# EAGLE design familab_pov_finished (EAGLE 6.5.0)
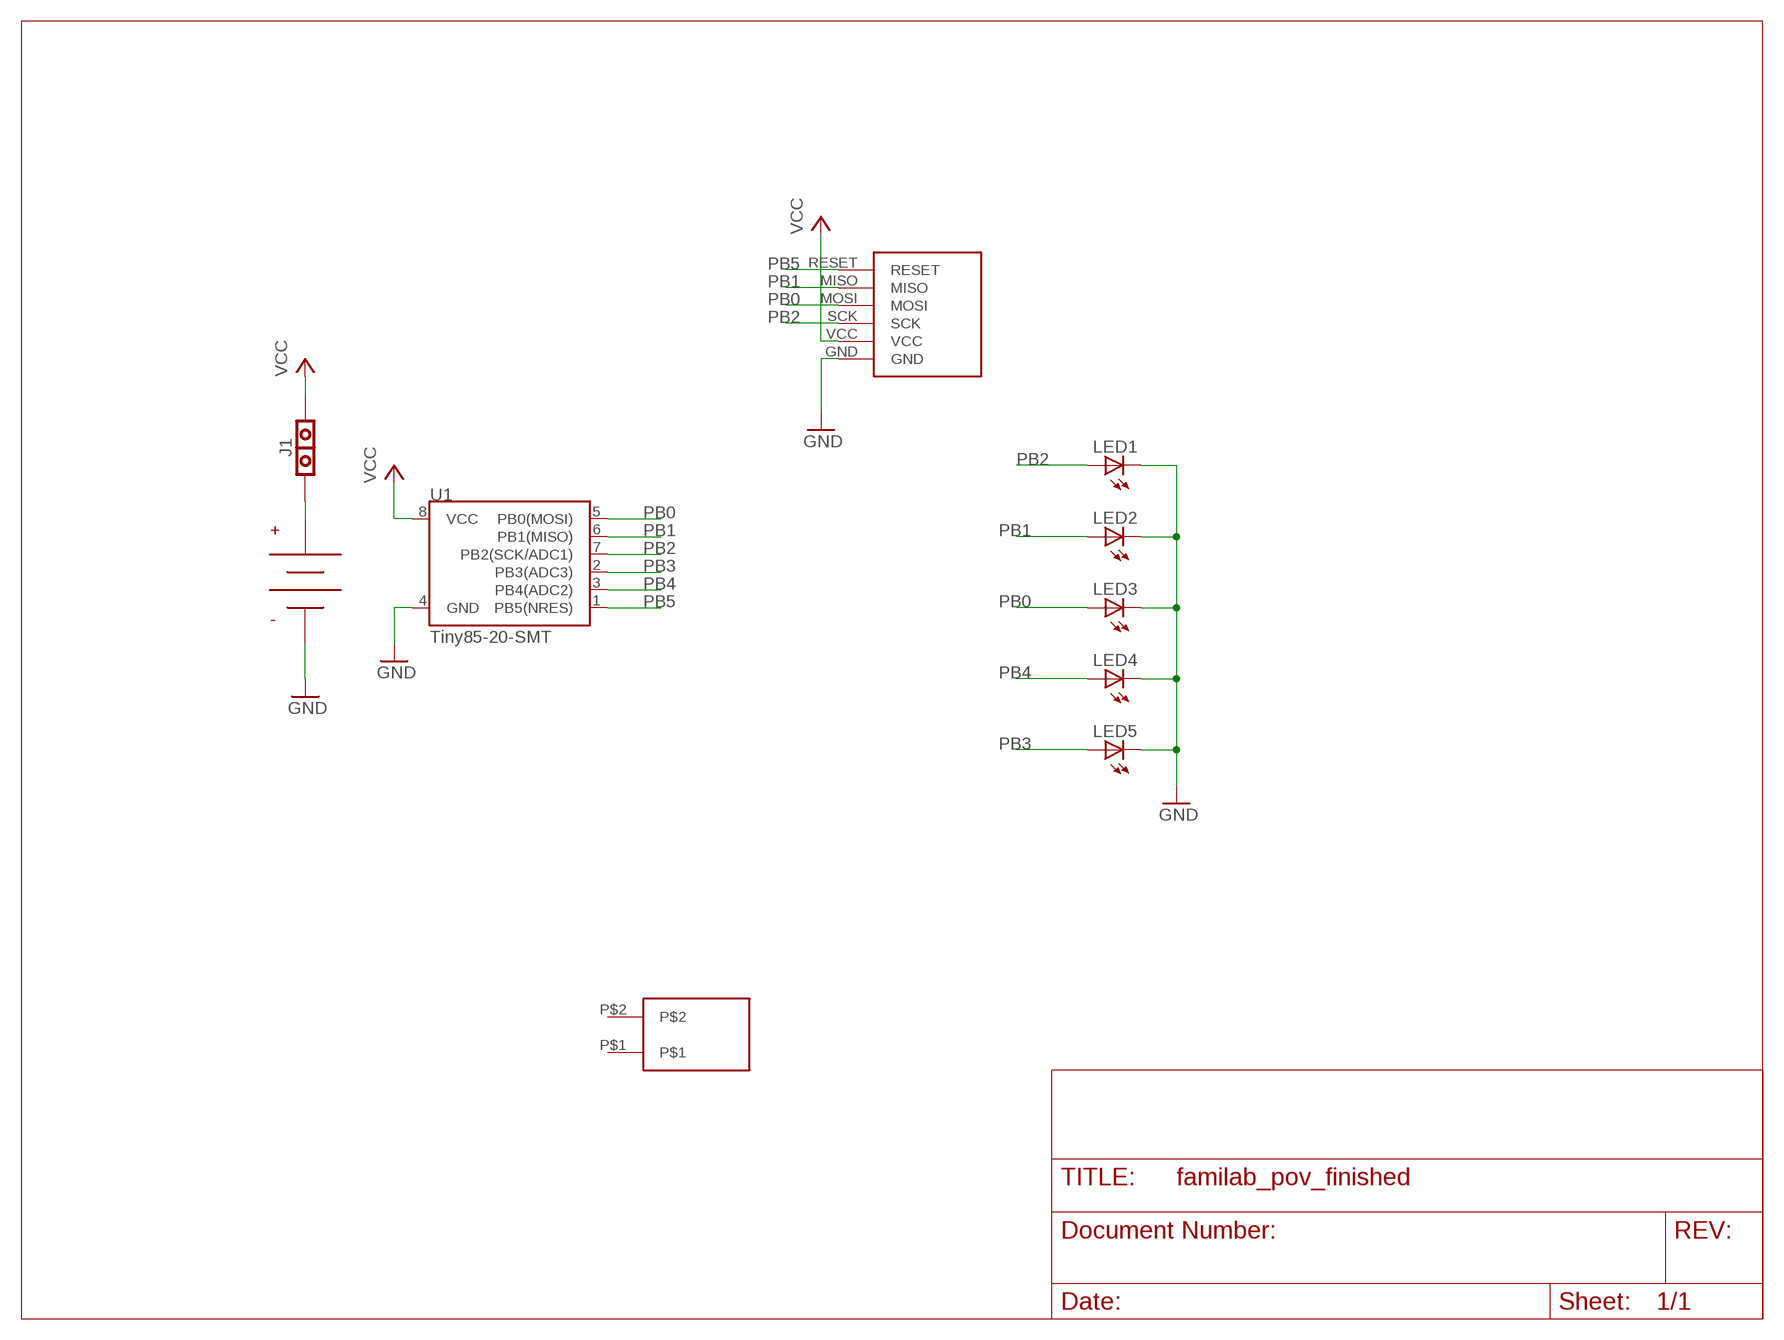
[diagram p0: schematic, sheet 1]

## Parts
J1  JUMPERSIDE  [JUMPER_SMD_SIDE]
LED1  LEDLED_5MM_SMD_SIDE  [LED5MM_SMD_SIDE]
LED2  LEDLED_5MM_SMD_SIDE  [LED5MM_SMD_SIDE]
LED3  LEDLED_5MM_SMD_SIDE  [LED5MM_SMD_SIDE]
LED4  LEDLED_5MM_SMD_SIDE  [LED5MM_SMD_SIDE]
LED5  LEDLED_5MM_SMD_SIDE  [LED5MM_SMD_SIDE]
U1  Tiny85-20-SMT  ATTINY45TINY85-20-SMT  [SO08-EIAJ]
U$1  CR2032_HOLDER  [CR2032_BC2032-F1]
U$2  MOUNTING_PAD  [MOUNTING_PADS]
U$4  ICSP_PROGRAM  [POV_ISP_CONNECTOR]

## Nets
GND: LED1.CATHODE(C) LED2.CATHODE(C) LED3.CATHODE(C) LED4.CATHODE(C) LED5.CATHODE(C) U1.4(GND) U$1.NEG U$4.GND
N$1: J1.P$1 U$1.POS
PB0: LED3.ANODE(A) U1.5(PB0(MOSI)) U$4.MOSI
PB1: LED2.ANODE(A) U1.6(PB1(MISO)) U$4.MISO
PB2: LED1.ANODE(A) U1.7(PB2(SCK/ADC1)) U$4.SCK
PB3: LED5.ANODE(A) U1.2(PB3(ADC3))
PB4: LED4.ANODE(A) U1.3(PB4(ADC2))
PB5: U1.1(PB5(NRES)) U$4.RESET
VCC: J1.P$2 U1.8(VCC) U$4.VCC
Unconnected: U$2.P$1 U$2.P$2

## Library data of the parts
J1 = pov_class_finished:JUMPER: JUMPER 2-PIN 0.1" PITCH FOR STANDARD HEADERS
LED1-LED5 = pov_class:LED: LED OSRAM: - CHIPLED LG R971, LG N971, LY N971, LG Q971, LY Q971, LO R971, LY R971 LH N974, LH R974 LS Q976, LO Q976, LY Q976 LO Q996 - Hyper CHIPLED LW Q18S LB Q993, LB Q99A, LB R99A - SideLED LS A670, LO A670, LY A670, LG A670, LP A670 LB A673, LV A673, LT A673, LW A673 LH A674 LY A675 LS A676, LA A676, LO A676, LY A676, LW A676 LS A679, LY A679, LG A679 - Hyper Micro SIDELED® LS Y876, LA Y876, LO Y876, LY Y876 LT Y87S - SmartLED LW L88C, LW L88S LB L89C, LB L89S, LG L890 LS L89K, LO L89K, LY L89K LS L896, LA L896, LO L896, LY L896 - TOPLED LS T670, LO T670, LY T670, LG T670, LP T670 LSG T670, LSP T670, LSY T670, LOP T670, LYG T670 LG T671, LOG T671, LSG T671 LB T673, LV T673, LT T673, LW T673 LH T674 LS T676, LA T676, LO T676, LY T676, LB T676, LH T676, LSB T676, LW T676 LB T67C, LV T67C, LT T67C, LS T67K, LO T67K, LY T67K, LW E67C LS E67B, LA E67B, LO E67B, LY E67B, LB E67C, LV E67C, LT E67C LW T67C LS T679, LY T679, LG T679 LS T770, LO T770, LY T770, LG T770, LP T770 LB T773, LV T773, LT T773, LW T773 LH T774 LS E675, LA E675, LY E675, LS T675 LS T776, LA T776, LO T776, LY T776, LB T776 LHGB T686 LT T68C, LB T68C - Hyper Mini TOPLED® LB M676 - Mini TOPLED Santana® LG M470 LS M47K, LO M47K, LY M47K Source: http://www.osram.convergy.de LUXEON: - LUMILED® LXK2-PW12-R00, LXK2-PW12-S00, LXK2-PW14-U00, LXK2-PW14-V00 LXK2-PM12-R00, LXK2-PM12-S00, LXK2-PM14-U00 LXK2-PE12-Q00, LXK2-PE12-R00, LXK2-PE12-S00, LXK2-PE14-T00, LXK2-PE14-U00 LXK2-PB12-K00, LXK2-PB12-L00, LXK2-PB12-M00, LXK2-PB14-N00, LXK2-PB14-P00, LXK2-PB14-Q00 LXK2-PR12-L00, LXK2-PR12-M00, LXK2-PR14-Q00, LXK2-PR14-R00 LXK2-PD12-Q00, LXK2-PD12-R00, LXK2-PD12-S00 LXK2-PH12-R00, LXK2-PH12-S00 LXK2-PL12-P00, LXK2-PL12-Q00, LXK2-PL12-R00 Source: www.luxeon.com KINGBRIGHT: KA-3528ASYC Source: www.kingbright.com
U1 = SparkFun-DigitalIC:ATTINY45: Atmel 8-pin 2/4/8kB flash uC; PROD_ID: IC-09092
U$1 = pov_class:CR2032_HOLDER
U$2 = pov_class:MOUNTING_PAD
U$4 = pov_class_finished:ICSP_PROGRAM

## Board
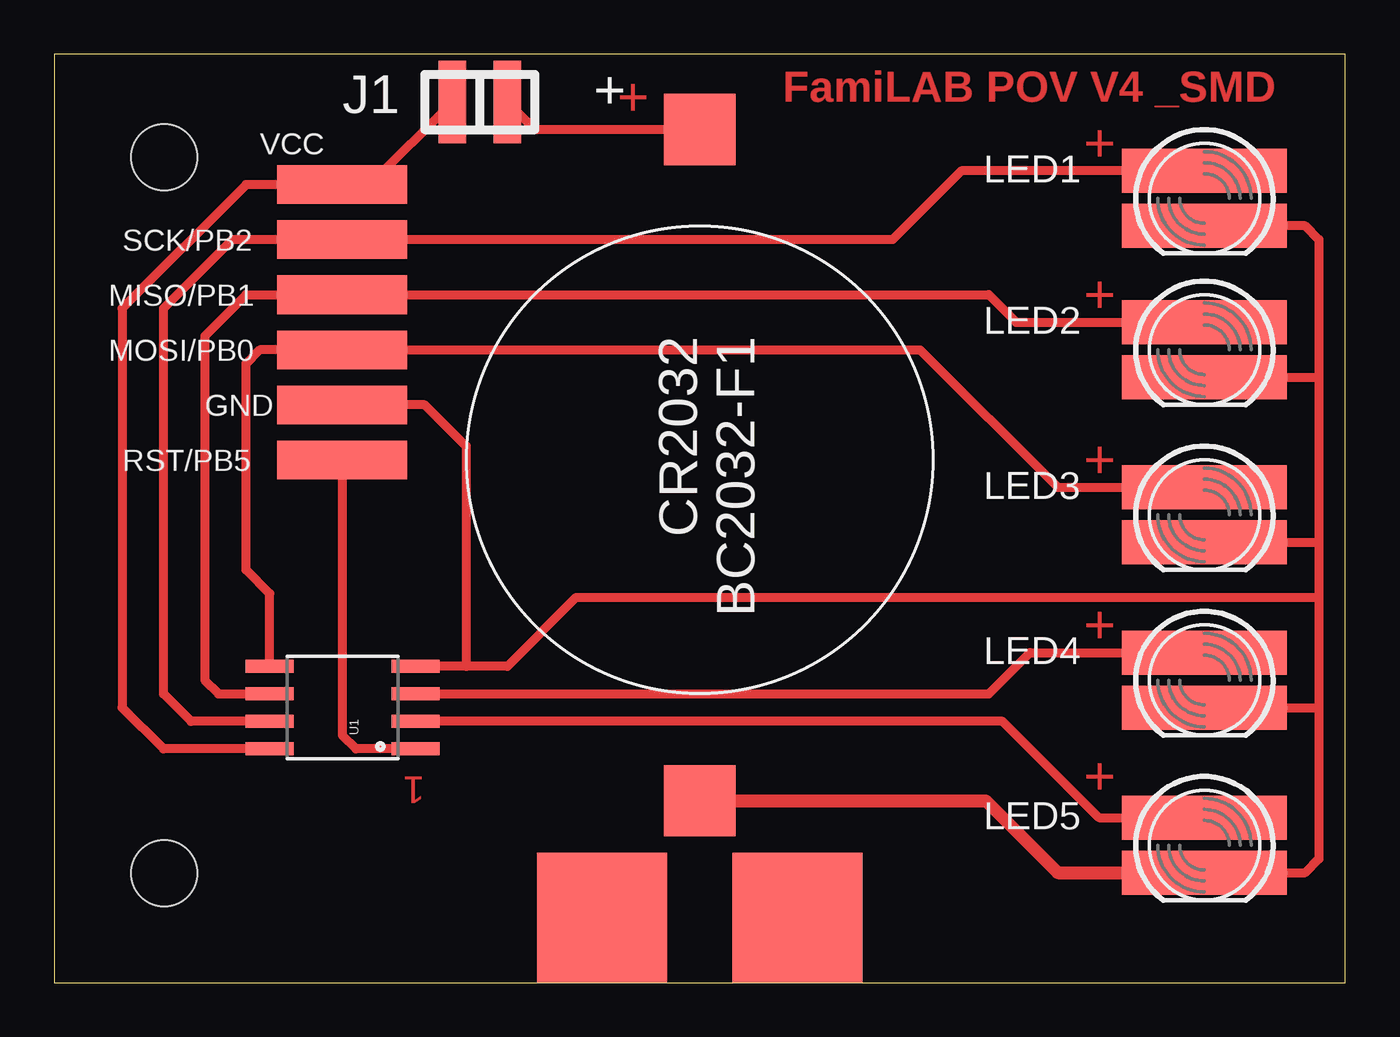
[diagram p1: board, top side]

Size 59.6 x 42.85 mm. Coordinates in mm from the lower left corner, seen from the top.
Outline: 0,0 59.6,0 59.6,42.85 0,42.85 0,0
Copper layers (1*16): Top 0.035mm / dielectric 1.5mm / Bottom 0.035mm
Design rules "default": minimum track width 10mil, minimum drill 24mil, track to track 8mil, track to pad 8mil, pad to pad 8mil, via to via 8mil, smd to smd 8mil, copper to edge 40mil, drill to drill 8mil, minimum pad ring 10mil, minimum via ring 8mil, stop-mask expansion 4mil, vias tented up to drill 0mil, thermal gap 10mil
Holes 3.05 mm at 5.08,5.05 5.08,38.1

### Footprints (pad centres in the part's own frame; a part is rotated, then mirrored left to right if it is on the bottom)
JUMPER_SMD_SIDE = smd 1.27 x 3.81: P$1 -2.54,0; P$2 0,0
LED5MM_SMD_SIDE = smd 2.032 x 7.62: ANODE -1.27,0; CATHODE 1.27,0
SO08-EIAJ = smd 0.61 x 2.21: 1 -1.905,-3.378; 2 -0.635,-3.378; 3 0.635,-3.378; 4 1.905,-3.378; 5 1.905,3.353; 6 0.635,3.353; 7 -0.635,3.353; 8 -1.905,3.353
CR2032_BC2032-F1 = smd 3.29 x 3.29: NEG 30.97,0; POS 0,0
MOUNTING_PADS = smd 6 x 6: P$1 -4.5,0; P$2 4.5,0
POV_ISP_CONNECTOR = smd 6 x 1.778: GND 0,-2.54; MISO 0,2.54; MOSI 0,0; RESET 0,-5.08; SCK 0,5.08; VCC 0,7.62

### Placement (x,y rotation side)
J1  18.38,40.64 180 top
LED1  53.09,36.2 270 top
LED2  53.09,29.21 270 top
LED3  53.09,21.59 270 top
LED4  53.09,13.97 270 top
LED5  53.09,6.35 270 top
U1  13.3,12.7 90 top
U$1  29.8,39.37 270 top
U$2  29.8,3 0 top
U$4  13.3,29.21 0 top

### Tracks (layer width: path | path; a pad name or v marks a point on that pad's centre or on a via)
GND
  Top 0.406: 29.81,9.53 U$1.NEG 28.39,6.99 | 58.38,27.94 58.38,34.29 57.75,34.92 LED1.CATHODE | 58.38,27.94 58.38,20.32 | 58.38,20.32 58.38,17.78 | 58.38,17.78 58.38,12.7 | 58.38,12.7 58.38,5.71 57.75,5.08 53.94,5.08 LED5.CATHODE | LED4.CATHODE 58.38,12.7 | LED3.CATHODE 58.38,20.32 | LED2.CATHODE 58.38,27.94 | 19.02,14.61 20.92,14.61 24.09,17.78 58.38,17.78 | 19.02,14.61 U1.4 | U$4.GND 17.11,26.67 19.02,24.77 19.02,14.61
  Top 0.61: U$1.NEG 43,8.4 46.32,5.08 53.94,5.08
N$1
  Top 0.406: U$1.POS 22.19,39.37 J1.P$1
PB0
  Top 0.406: 53.94,22.86 LED3.ANODE 46.32,22.86 39.97,29.21 U$4.MOSI 9.49,29.21 8.86,28.57 8.86,19.05 9.95,17.96 U1.5
PB1
  Top 0.406: U1.6 7.58,13.34 6.95,13.97 6.95,29.84 8.86,31.75 U$4.MISO 43.15,31.75 44.41,30.48 LED2.ANODE
PB2
  Top 0.406: LED1.ANODE 41.88,37.47 38.7,34.29 U$4.SCK 8.22,34.29 5.04,31.11 5.04,13.34 6.32,12.06 U1.7
PB3
  Top 0.406: LED5.ANODE 48.23,7.62 43.78,12.06 U1.2
PB4
  Top 0.406: 50.77,15.24 LED4.ANODE 45.05,15.24 43.15,13.34 U1.3
PB5
  Top 0.406: U1.1 13.94,10.79 13.3,11.43 U$4.RESET
VCC
  Top 0.406: U1.8 5.04,10.79 3.14,12.7 3.14,31.11 8.86,36.83 U$4.VCC 14.57,36.83 J1.P$2 18.38,40.01
(copper drawn outside any net)
  shapes: Top circle x2

### Text on the board
Top: FamiLAB POV V4 _SMD | + | + | + | + | + | 1 | +